# Altium schematic sheet Interfaces.SchDoc
size A4; Author: Yaokun/Felix Zhang; Organization: Altium Limited; Address1: 21A144; Address2: Harbin Engineering University; Address3: Harbin; Address4: CHINA
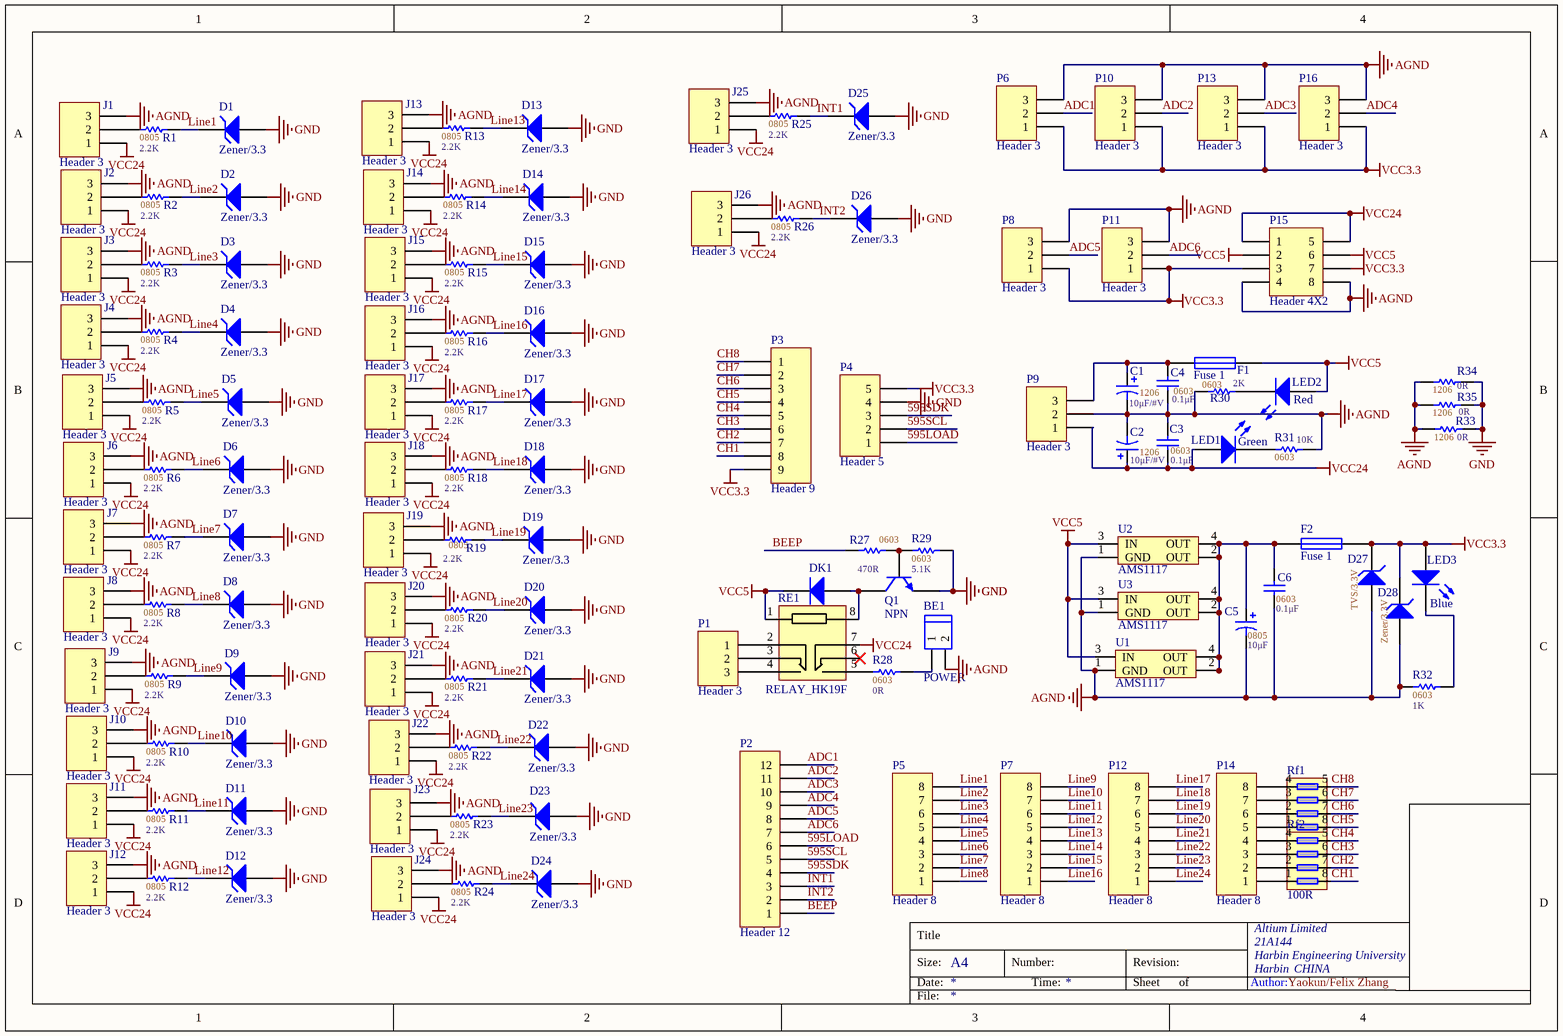
[diagram p0: Interfaces.SchDoc]

## Parts
BE1  POWER  [H2_Push_out3.81]
C1  value 10μF/#V  PackageReference: 1206  [CAP_1206]  (hidden comment: Polar)
C2  value 10μF/#V  PackageReference: 1206  [CAP_1206]  (hidden comment: Polar)
C3  value 0.1μF  [CAP_0603_16*08]  (hidden comment: 0603)
C4  value 0.1μF  [CAP_0603_16*08]  (hidden comment: 0603)
C5  value 10μF  PackageReference: 0805  [CAP_0805_20*12]  (hidden comment: Polar)
C6  value 0.1μF  [CAP_0603_16*08]  (hidden comment: 0603)
D1  Zener/3.3  [SOD323]
D2  Zener/3.3  [SOD323]
D3  Zener/3.3  [SOD323]
D4  Zener/3.3  [SOD323]
D5  Zener/3.3  [SOD323]
D6  Zener/3.3  [SOD323]
D7  Zener/3.3  [SOD323]
D8  Zener/3.3  [SOD323]
D9  Zener/3.3  [SOD323]
D10  Zener/3.3  [SOD323]
D11  Zener/3.3  [SOD323]
D12  Zener/3.3  [SOD323]
D13  Zener/3.3  [SOD323]
D14  Zener/3.3  [SOD323]
D15  Zener/3.3  [SOD323]
D16  Zener/3.3  [SOD323]
D17  Zener/3.3  [SOD323]
D18  Zener/3.3  [SOD323]
D19  Zener/3.3  [SOD323]
D20  Zener/3.3  [SOD323]
D21  Zener/3.3  [SOD323]
D22  Zener/3.3  [SOD323]
D23  Zener/3.3  [SOD323]
D24  Zener/3.3  [SOD323]
D25  Zener/3.3  [SOD323]
D26  Zener/3.3  [SOD323]
D27  TVS/3.3V  [SOD523]
D28  Zener/3.3V  [SOD323]
DK1  Diode  [Diode1206]
F1  Fuse 1  [FUSE3.5*5.5]
F2  Fuse 1  [FUSE3.5*5.5]
J1  Header 3  [P3_OUT]
J2  Header 3  [P3_OUT]
J3  Header 3  [P3_OUT]
J4  Header 3  [P3_OUT]
J5  Header 3  [P3_OUT]
J6  Header 3  [P3_OUT]
J7  Header 3  [P3_OUT]
J8  Header 3  [P3_OUT]
J9  Header 3  [P3_OUT]
J10  Header 3  [P3_OUT]
J11  Header 3  [P3_OUT]
J12  Header 3  [P3_OUT]
J13  Header 3  [P3_OUT]
J14  Header 3  [P3_OUT]
J15  Header 3  [P3_OUT]
J16  Header 3  [P3_OUT]
J17  Header 3  [P3_OUT]
J18  Header 3  [P3]
J19  Header 3  [P3]
J20  Header 3  [P3]
J21  Header 3  [P3]
J22  Header 3  [P3]
J23  Header 3  [P3]
J24  Header 3  [P3]
J25  Header 3  [P3_OUT]
J26  Header 3  [P3_OUT]
LED1  Green  [LED_0805]
LED2  Red  [LED_0805]
LED3  Blue  [LED_0805]
P1  Header 3  [P3_OUT]
P2  Header 12  [P12_OUT]
P3  Header 9  [P9]
P4  Header 5  [Header5_KF2510]
P5  Header 8  [P8_OUT]
P6  Header 3  [P3_OUT]
P7  Header 8  [P8_OUT]
P8  Header 3  [P3]
P9  Header 3  [Header3_HC5.08]
P10  Header 3  [P3_OUT]
P11  Header 3  [P3]
P12  Header 8  [P8_OUT]
P13  Header 3  [P3_OUT]
P14  Header 8  [P8_OUT]
P15  Header 4X2  [HEADER2*4_PIN]
P16  Header 3  [P3_OUT]
Q1  NPN  [SOT23_J3Y]
R1  value 2.2K  PackageReference: 0805  [RES_0805_20*12]  (hidden comment: SMD)
R2  value 2.2K  PackageReference: 0805  [RES_0805_20*12]  (hidden comment: SMD)
R3  value 2.2K  PackageReference: 0805  [RES_0805_20*12]  (hidden comment: SMD)
R4  value 2.2K  PackageReference: 0805  [RES_0805_20*12]  (hidden comment: SMD)
R5  value 2.2K  PackageReference: 0805  [RES_0805_20*12]  (hidden comment: SMD)
R6  value 2.2K  PackageReference: 0805  [RES_0805_20*12]  (hidden comment: SMD)
R7  value 2.2K  PackageReference: 0805  [RES_0805_20*12]  (hidden comment: SMD)
R8  value 2.2K  PackageReference: 0805  [RES_0805_20*12]  (hidden comment: SMD)
R9  value 2.2K  PackageReference: 0805  [RES_0805_20*12]  (hidden comment: SMD)
R10  value 2.2K  PackageReference: 0805  [RES_0805_20*12]  (hidden comment: SMD)
R11  value 2.2K  PackageReference: 0805  [RES_0805_20*12]  (hidden comment: SMD)
R12  value 2.2K  PackageReference: 0805  [RES_0805_20*12]  (hidden comment: SMD)
R13  value 2.2K  PackageReference: 0805  [RES_0805_20*12]  (hidden comment: SMD)
R14  value 2.2K  PackageReference: 0805  [RES_0805_20*12]  (hidden comment: SMD)
R15  value 2.2K  PackageReference: 0805  [RES_0805_20*12]  (hidden comment: SMD)
R16  value 2.2K  PackageReference: 0805  [RES_0805_20*12]  (hidden comment: SMD)
R17  value 2.2K  PackageReference: 0805  [RES_0805_20*12]  (hidden comment: SMD)
R18  value 2.2K  PackageReference: 0805  [RES_0805_20*12]  (hidden comment: SMD)
R19  value 2.2K  PackageReference: 0805  [RES_0805_20*12]  (hidden comment: SMD)
R20  value 2.2K  PackageReference: 0805  [RES_0805_20*12]  (hidden comment: SMD)
R21  value 2.2K  PackageReference: 0805  [RES_0805_20*12]  (hidden comment: SMD)
R22  value 2.2K  PackageReference: 0805  [RES_0805_20*12]  (hidden comment: SMD)
R23  value 2.2K  PackageReference: 0805  [RES_0805_20*12]  (hidden comment: SMD)
R24  value 2.2K  PackageReference: 0805  [RES_0805_20*12]  (hidden comment: SMD)
R25  value 2.2K  PackageReference: 0805  [RES_0805_20*12]  (hidden comment: SMD)
R26  value 2.2K  PackageReference: 0805  [RES_0805_20*12]  (hidden comment: SMD)
R27  value 470R  PackageReference: 0603  [RES_0603_16*08]  (hidden comment: SMD)
R28  value 0R  PackageReference: 0603  [RES_0805_20*12]  (hidden comment: SMD)
R29  value 5.1K  PackageReference: 0603  [RES_0603_16*08]  (hidden comment: SMD)
R30  value 2K  PackageReference: 0603  [RES_0805_20*12]  (hidden comment: SMD)
R31  value 10K  PackageReference: 0603  [RES_0805_20*12]  (hidden comment: SMD)
R32  value 1K  PackageReference: 0603  [RES_0805_20*12]  (hidden comment: SMD)
R33  value 0R  PackageReference: 1206  [RES_1206]  (hidden comment: SMD)
R34  value 0R  PackageReference: 1206  [RES_1206]  (hidden comment: SMD)
R35  value 0R  PackageReference: 1206  [RES_1206]  (hidden comment: SMD)
RE1  RELAY_HK19F  [Relay_HK19F]
Rf1  100R  [RES_FOUR_0603]
Rf2  100R  [RES_FOUR_0603]
U1  AMS1117  [SOT223_M]
U2  AMS1117  [SOT223_M]
U3  AMS1117  [SOT223_M]

## Nets
AGND: BE1.2 C1.2 C2.2 C3.2 C4.1 C5.2 C6.1 D27.1(A) D28.1(A) J1.3 J2.3 J3.3 J4.3 J5.3 J6.3 J7.3 J8.3 J9.3 J10.3 J11.3 J12.3 J13.3 J14.3 J15.3 J16.3 J17.3 J18.3 J19.3 J20.3 J21.3 J22.3 J23.3 J24.3 J25.3 J26.3 P6.3 P8.3 P9.2 P10.3 P11.3 P13.3 P15.4 P15.8 P16.3 R30.1 R31.2 R32.2 R33.1 R34.1 R35.1 U1.1(GND) U2.1(GND) U3.1(GND)
GND: D1.1(A) D2.1(A) D3.1(A) D4.1(A) D5.1(A) D6.1(A) D7.1(A) D8.1(A) D9.1(A) D10.1(A) D11.1(A) D12.1(A) D13.1(A) D14.1(A) D15.1(A) D16.1(A) D17.1(A) D18.1(A) D19.1(A) D20.1(A) D21.1(A) D22.1(A) D23.1(A) D24.1(A) D25.1(A) D26.1(A) P4.4 Q1.3(E) R29.2 R33.2 R34.2 R35.2
VCC3.3: D27.2(K) D28.2(K) F2.2 LED3.1(A) P3.9 P4.5 P6.1 P8.1 P10.1 P11.1 P13.1 P15.3 P15.7 P16.1
VCC5: DK1.2(K) F1.2 LED2.1(A) P15.2 P15.6 RE1.1(VCC) U1.3(IN) U2.3(IN) U3.3(IN)
VCC24: C2.1 C3.1 J1.1 J2.1 J3.1 J4.1 J5.1 J6.1 J7.1 J8.1 J9.1 J10.1 J11.1 J12.1 J13.1 J14.1 J15.1 J16.1 J17.1 J18.1 J19.1 J20.1 J21.1 J22.1 J23.1 J24.1 J25.1 J26.1 LED1.1(A) P9.1 P15.1 P15.5 RE1.7
595LOAD: P2.6 P4.1
595SCL: P2.5 P4.2
595SDK: P2.4 P4.3
ADC1: P2.12 P6.2
ADC2: P2.11 P10.2
ADC3: P2.10 P13.2
ADC4: P2.9 P16.2
ADC5: P2.8 P8.2
ADC6: P2.7 P11.2
BEEP: P2.1 R27.1
CH1: P3.8 Rf2.8
CH2: P3.7 Rf2.7
CH3: P3.6 Rf2.6
CH4: P3.5 Rf2.5
CH5: P3.4 Rf1.8
CH6: P3.3 Rf1.7
CH7: P3.2 Rf1.6
CH8: P3.1 Rf1.5
INT1: D25.2(K) P2.3 R25.1
INT2: D26.2(K) P2.2 R26.1
Line1: D1.2(K) P5.8 R1.1
Line2: D2.2(K) P5.7 R2.1
Line3: D3.2(K) P5.6 R3.1
Line4: D4.2(K) P5.5 R4.1
Line5: D5.2(K) P5.4 R5.1
Line6: D6.2(K) P5.3 R6.1
Line7: D7.2(K) P5.2 R7.1
Line8: D8.2(K) P5.1 R8.1
Line9: D9.2(K) P7.8 R9.1
Line10: D10.2(K) P7.7 R10.1
Line11: D11.2(K) P7.6 R11.1
Line12: D12.2(K) P7.5 R12.1
Line13: D13.2(K) P7.4 R13.1
Line14: D14.2(K) P7.3 R14.1
Line15: D15.2(K) P7.2 R15.1
Line16: D16.2(K) P7.1 R16.1
Line17: D17.2(K) P12.8 R17.1
Line18: D18.2(K) P12.7 R18.1
Line19: D19.2(K) P12.6 R19.1
Line20: D20.2(K) P12.5 R20.1
Line21: D21.2(K) P12.4 R21.1
Line22: D22.2(K) P12.3 R22.1
Line23: D23.2(K) P12.2 R23.1
Line24: D24.2(K) P12.1 R24.1
NetBE1_1: BE1.1 R28.2
NetC1_1: C1.1 C4.2 F1.1 P9.3
NetC5_1: C5.1 C6.2 F2.1 U1.2(OUT) U1.4(OUT) U2.2(OUT) U2.4(OUT) U3.2(OUT) U3.4(OUT)
NetDK1_1: DK1.1(A) Q1.1(C) RE1.8(GND)
NetJ1_2: J1.2 R1.2
NetJ2_2: J2.2 R2.2
NetJ3_2: J3.2 R3.2
NetJ4_2: J4.2 R4.2
NetJ5_2: J5.2 R5.2
NetJ6_2: J6.2 R6.2
NetJ7_2: J7.2 R7.2
NetJ8_2: J8.2 R8.2
NetJ9_2: J9.2 R9.2
NetJ10_2: J10.2 R10.2
NetJ11_2: J11.2 R11.2
NetJ12_2: J12.2 R12.2
NetJ13_2: J13.2 R13.2
NetJ14_2: J14.2 R14.2
NetJ15_2: J15.2 R15.2
NetJ16_2: J16.2 R16.2
NetJ17_2: J17.2 R17.2
NetJ18_2: J18.2 R18.2
NetJ19_2: J19.2 R19.2
NetJ20_2: J20.2 R20.2
NetJ21_2: J21.2 R21.2
NetJ22_2: J22.2 R22.2
NetJ23_2: J23.2 R23.2
NetJ24_2: J24.2 R24.2
NetJ25_2: J25.2 R25.2
NetJ26_2: J26.2 R26.2
NetLED1_2: LED1.2(K) R31.1
NetLED2_2: LED2.2(K) R30.2
NetLED3_2: LED3.2(K) R32.1
NetP1_1: P1.1 RE1.2(COM)
NetP1_2: P1.2 RE1.3
NetP1_3: P1.3 RE1.4
NetP14_1: P14.1 Rf2.1
NetP14_2: P14.2 Rf2.2
NetP14_3: P14.3 Rf2.3
NetP14_4: P14.4 Rf2.4
NetP14_5: P14.5 Rf1.1
NetP14_6: P14.6 Rf1.2
NetP14_7: P14.7 Rf1.3
NetP14_8: P14.8 Rf1.4
NetQ1_2: Q1.2(B) R27.2 R29.1
NetR28_1: R28.1 RE1.5

Not connected (* = marked no-connect by the designer): RE1 6*

## Notes on the sheet
- Title
- Size:
- Date:
- A4
- Number:
- Time:
- Revision:
- Sheet
- of
- Author:
- File:

## Library data of the parts
BE1 = HEAD2
C1 C2 C5 = Cap Pol: Polarized Capacitor (Axial); LatestRevisionDate: 17-Jul-2002; LatestRevisionNote: Re-released for DXP Platform.; Publisher: Altium Limited; Published: 1206; PackageDescription: Polar
C3 C4 C6 = Cap: Capacitor; Published: 8-Jun-2000; LatestRevisionDate: 17-Jul-2002; LatestRevisionNote: Re-released for DXP Platform.; Publisher: Altium Limited; PackageDescription: 0603; PackageReference: 0603
D1-D28 = D Zener: Zener Diode; Published: 8-Jun-2000; LatestRevisionDate: 17-Jul-2002; LatestRevisionNote: Re-released for DXP Platform.; PackageReference: DIODE-0.7; Publisher: Altium Limited; PackageDescription: Diode, Thru-Hole; 2 Leads; 0.7 in Pin Spacing
DK1 = Diode: Default Diode; Published: 8-Jun-2000; LatestRevisionDate: 17-Jul-2002; LatestRevisionNote: Re-released for DXP Platform.; PackageVersion: Sep-1996; PackageReference: SMC; Publisher: Altium Limited; PackageDescription: DO-214-AB/SMC; 2 C-Bend Leads; Body 7.9 x 5.9 mm, inc. leads (LxW); Code_JEDEC: DO-214-AB
F1 F2 = Fuse 1: Fuse; Published: 8-Jun-2000; LatestRevisionDate: 17-Jul-2002; LatestRevisionNote: Re-released for DXP Platform.; PackageReference: PIN-W2/E2.8; Publisher: Altium Limited; PackageDescription: Thru-Hole; 2 Leads
J1-J26 P1 P6 P8-P11 P13 P16 = Header 3: Header, 3-Pin; LatestRevisionDate: 17-Jul-2002; LatestRevisionNote: Re-released for DXP Platform.; Publisher: Altium Limited
LED1-LED3 = LED: Typical RED, GREEN, YELLOW, AMBER GaAs LED; Published: 8-Jun-2000; LatestRevisionDate: 17-Jul-2002; LatestRevisionNote: Re-released for DXP Platform.; PackageVersion: Feb-2002; PackageReference: 3.2X1.6X1.1; Publisher: Altium Limited; PackageDescription: SM LED; 2 Flat Leads
P2 = Header 12: Header, 12-Pin; LatestRevisionDate: 17-Jul-2002; LatestRevisionNote: Re-released for DXP Platform.; Publisher: Altium Limited
P3 = Header 9: Header, 9-Pin; LatestRevisionDate: 17-Jul-2002; LatestRevisionNote: Re-released for DXP Platform.; Publisher: Altium Limited
P4 = Header 5: Header, 5-Pin; LatestRevisionDate: 17-Jul-2002; LatestRevisionNote: Re-released for DXP Platform.; Publisher: Altium Limited
P5 P7 P12 P14 = Header 8: Header, 8-Pin; LatestRevisionDate: 17-Jul-2002; LatestRevisionNote: Re-released for DXP Platform.; Publisher: Altium Limited
P15 = Header 4X2: Header, 4-Pin, Dual row; LatestRevisionDate: 17-Jul-2002; LatestRevisionNote: Re-released for DXP Platform.; Publisher: Altium Limited
Q1 = NPN: NPN Bipolar Transistor; Published: 8-Jun-2000; LatestRevisionDate: 17-Jul-2002; LatestRevisionNote: Re-released for DXP Platform.; PackageReference: TO-226-AA; Publisher: Altium Limited; PackageDescription: TO, Flat Index; 3 In-Line, Axial Leads; Body Dia. 4.8mm; Leads 0.55 x 0.51 mm (max); Code_JEDEC: TO-226-AA
R1-R35 = RES_SMD: Resistor; Published: 8-Jun-2000; LatestRevisionDate: 17-Jul-2002; LatestRevisionNote: Re-released for DXP Platform.; Publisher: Altium Limited; PackageDescription: SMD
Rf1 Rf2 = RES_4P